# Altium schematic sheet Sheet8.SchDoc
size 368 x 398 mm
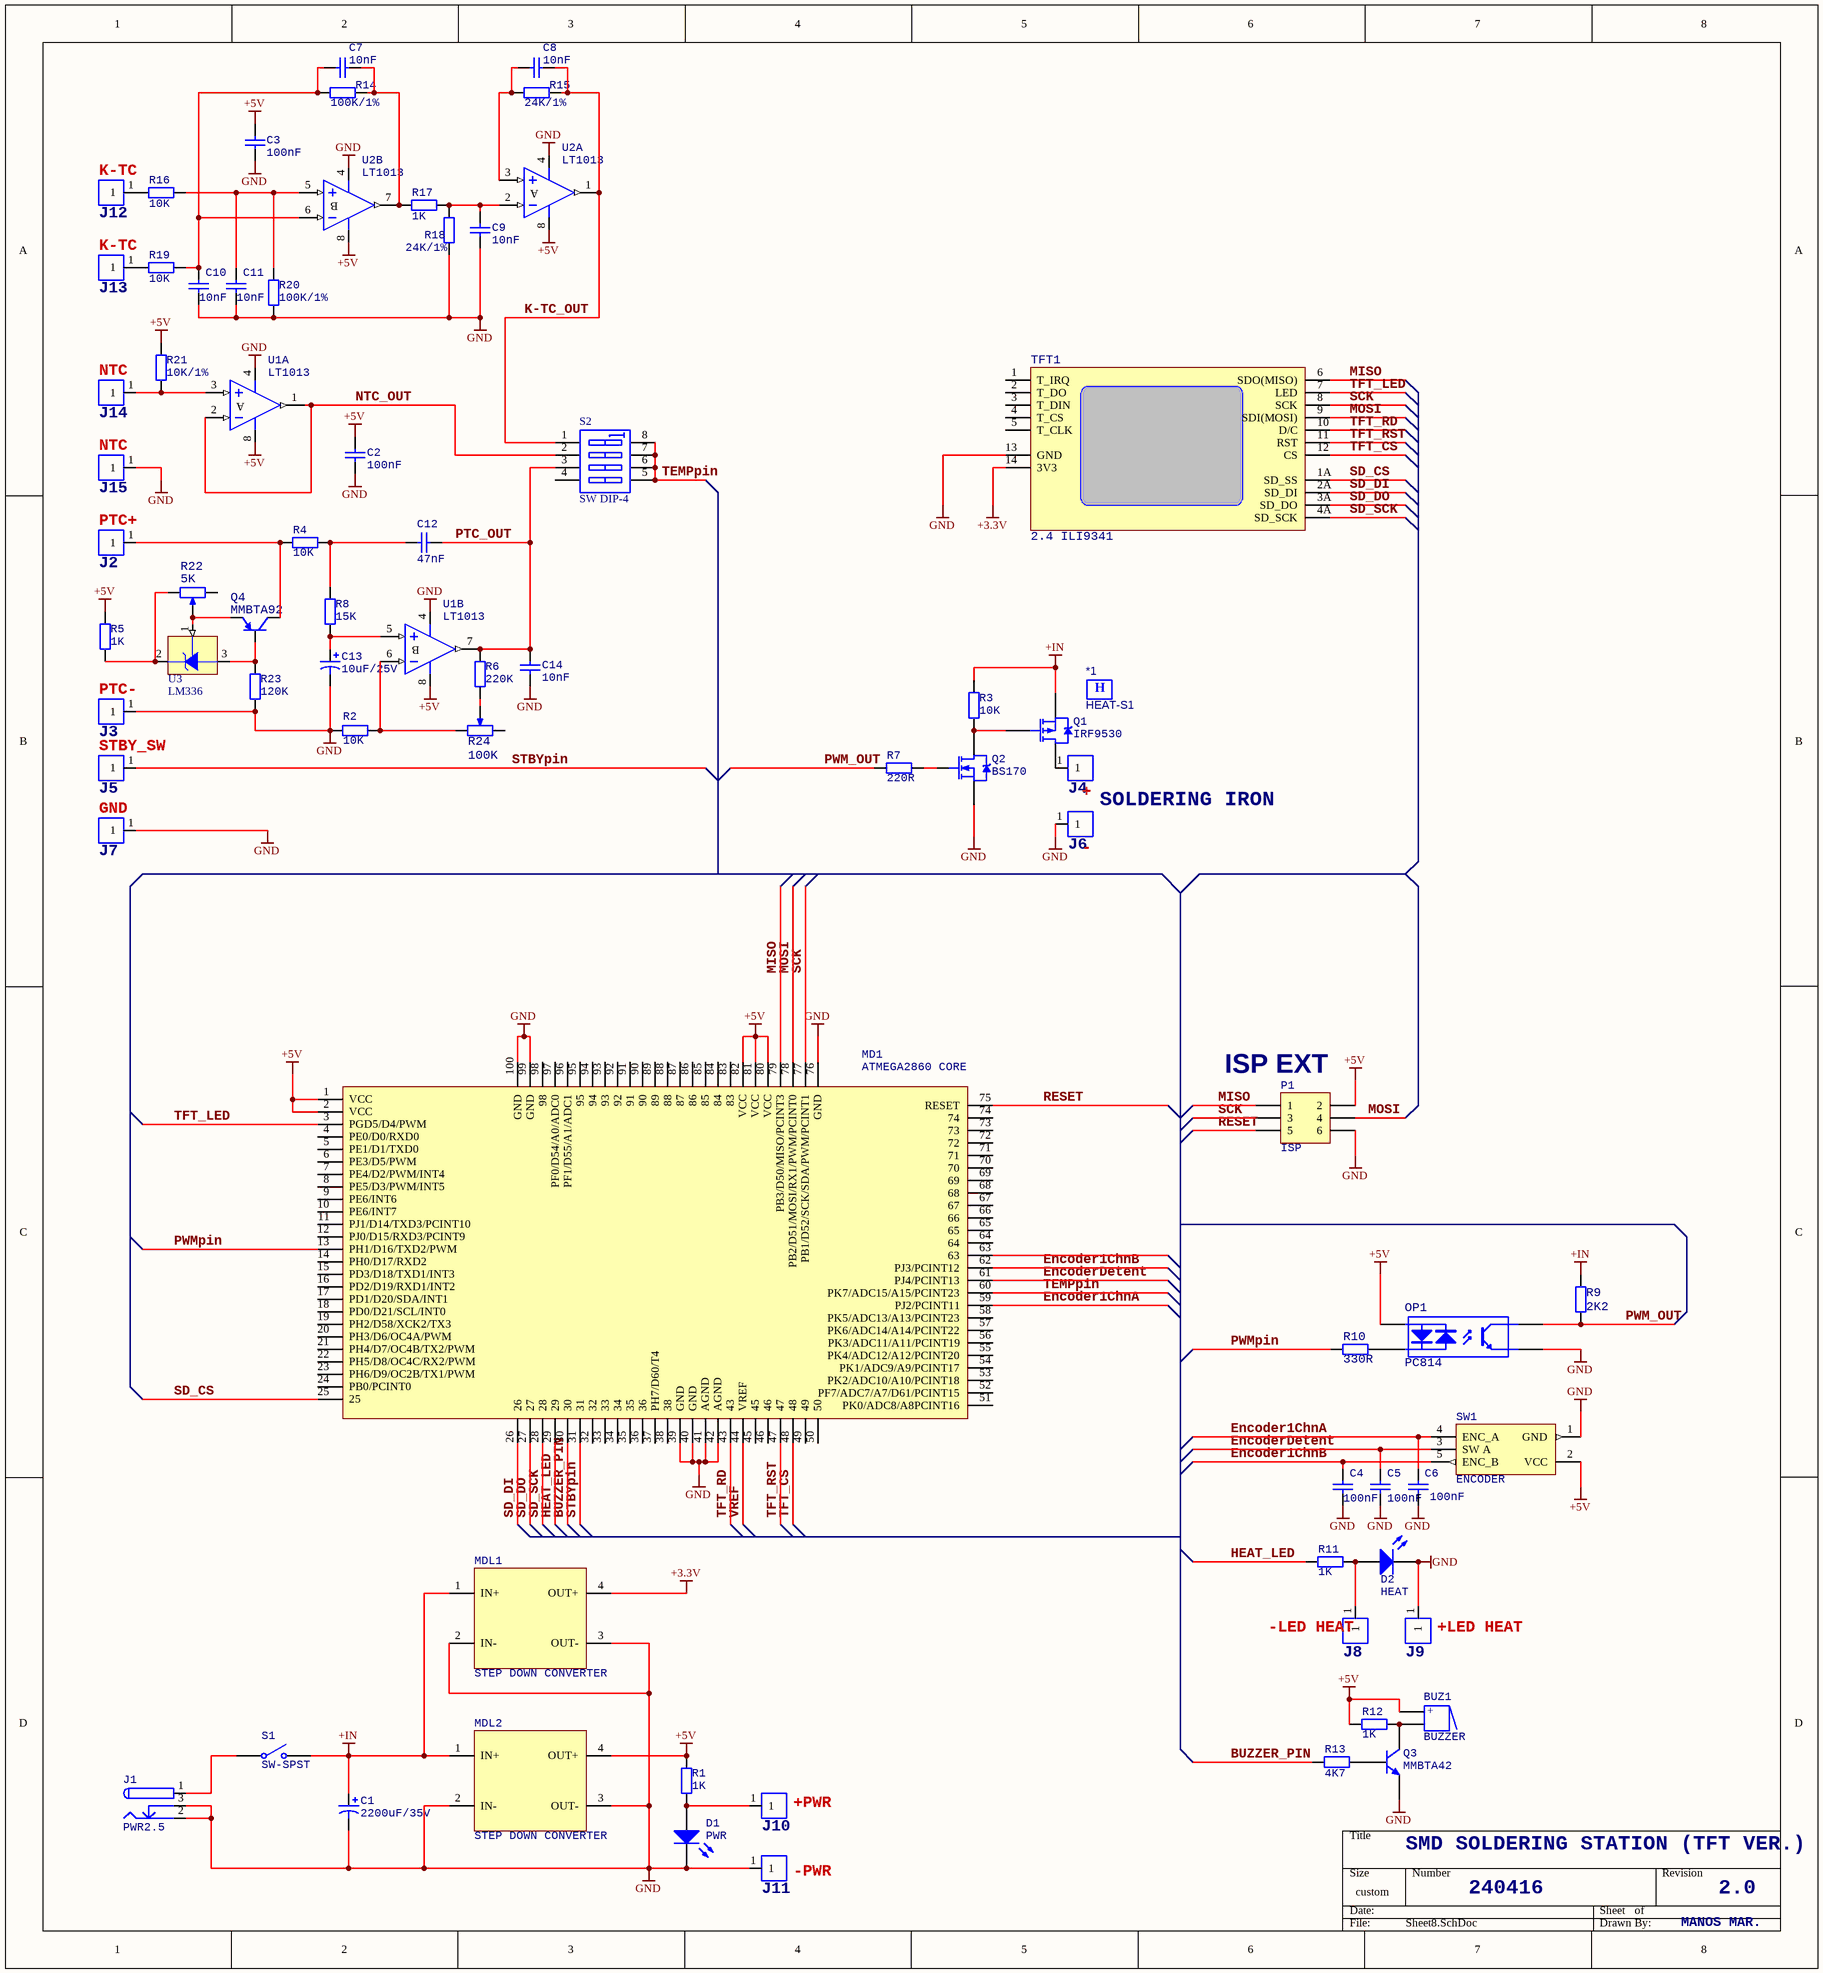
[diagram p0: Sheet8.SchDoc]

## Parts
*1  HEAT-S1  [SK 104 HEATSHINK]
BUZ1  BUZZER  [BUZZER]
C1  2200uF/35V  [RB5-10.5]
C2  100nF  [0805]
C3  100nF  [0805]
C4  100nF  [0805]
C5  100nF  [0805]
C6  100nF  [0805]
C7  10nF  [0805]
C8  10nF  [0805]
C9  10nF  [0805]
C10  10nF  [0805]
C11  10nF  [0805]
C12  47nF  [0805]
C13  10uF/25V  [RB-08]
C14  10nF  [0805]
D1  PWR  [1206D]
D2  HEAT  [1206D]
J1  PWR2.5  [POWER JACK]
J2  PTC+  [CON2]
J3  PTC-  [CON2]
J4  +  [CON2]
J5  STBY_SW  [CON2]
J6  -  [CON2]
J7  GND  [CON2]
J8  -LED HEAT  [CON2]
J9  +LED HEAT  [CON2]
J10  +PWR  [CON2]
J11  -PWR  [CON2]
J12  K-TC  [CON2]
J13  K-TC  [CON2]
J14  NTC  [CON2]
J15  NTC  [CON2]
MD1  ATMEGA2860 CORE  [ATMEGA 2560 CORE]
MDL1  STEP DOWN CONVERTER  [STEP DOWN CONVERTER MINI]
MDL2  STEP DOWN CONVERTER  [STEP DOWN CONVERTER MINI]
OP1  PC814  [SOP-4]
P1  ISP  [HDR2X3]
Q1  IRF9530  [TO-220V]
Q2  BS170  [T0-92]
Q3  MMBTA42  [SO-G3]
Q4  MMBTA92  [SO-G3]
R1  1K  [0805]
R2  10K  [0805]
R3  10K  [0805]
R4  10K  [0805]
R5  1K  [0805]
R6  220K  [0805]
R7  220R  [0805]
R8  15K  [0805]
R9  2K2  [0805]
R10  330R  [0805]
R11  1K  [0805]
R12  1K  [0805]
R13  4K7  [0805]
R14  100K/1%  [0805]
R15  24K/1%  [0805]
R16  10K  [0805]
R17  1K  [0805]
R18  24K/1%  [0805]
R19  10K  [0805]
R20  100K/1%  [0805]
R21  10K/1%  [0805]
R22  5K  [VR6]
R23  120K  [0805]
R24  100K  [VR6]
S1  SW-SPST  [SPST-2]
S2  SW DIP-4  [DIP-8]
SW1  ENCODER  [HDR1X5]
TFT1  2.4 ILI9341  [HDR1X18]
U1  LT1013  [DIP-8]  (parts A,B of 2)
U2  LT1013  [DIP-8]  (parts A,B of 2)
U3  LM336  [Z03A]

## Nets
+3.3V: MDL1.4(OUT+) TFT1.14(3V3)
+5V: BUZ1.1 C2.2 C3.2 MD1.1(VCC) MD1.2(VCC) MD1.80(VCC) MD1.81(VCC) MD1.82(VCC) MDL2.4(OUT+) OP1.1(A) P1.2 R1.2 R5.2 R12.2 R21.2 SW1.2(VCC) U1.8(V+) U2.8(V+)
+IN: C1.1 MDL1.1(IN+) MDL2.1(IN+) Q1.3(S) R3.2 R9.1 S1.2(NO)
GND: C1.2 C2.1 C3.1 C4.2 C5.2 C6.2 C9.2 C10.1 C11.1 C13.2 C14.1 D1.2(K) D2.2(K) J1.2 J1.3 J3.1 J6.1 J7.1 J9.1 J11.1 J15.1 MD1.39(GND) MD1.40(GND) MD1.41(AGND) MD1.42(AGND) MD1.76(GND) MD1.99(GND) MD1.100(GND) MDL1.2(IN-) MDL1.3(OUT-) MDL2.2(IN-) MDL2.3(OUT-) OP1.3(E) P1.6 Q2.3(S) Q3.2(E) R2.2 R18.2 R20.1 R23.1 SW1.1(GND) TFT1.13(GND) U1.4(V-) U2.4(V-)
BUZZER_PIN: MD1.30 R13.1
Encoder1ChnA: C6.1 MD1.59(PJ2/PCINT11) SW1.4(ENC_A)
Encoder1ChnB: C4.1 MD1.62(PJ3/PCINT12) SW1.5(ENC_B)
EncoderDetent: C5.1 MD1.61(PJ4/PCINT13) SW1.3(SW_A)
HEAT_LED: MD1.29 R11.1
K-TC_OUT: C8.1 R15.1 S2.1(A1) U2.1(OUT)
MISO: MD1.79(PB3/D50/MISO/PCINT3) P1.1 TFT1.6(SDO(MISO))
MOSI: MD1.78(PB2/D51/MOSI/RX1/PWM/PCINT0) P1.4 TFT1.9(SDI(MOSI))
NTC_OUT: S2.2(A2) U1.1(OUT) U1.2(IN-)
PTC_OUT: C12.1 C14.2 R6.1 S2.3(A3) U1.7(OUT)
PWM_OUT: OP1.4(C) R7.1 R9.2
PWMpin: MD1.13(PH1/D16/TXD2/PWM) R10.2
RESET: MD1.75(RESET) P1.5
SCK: MD1.77(PB1/D52/SCK/SDA/PWM/PCINT1) P1.3 TFT1.8(SCK)
SD_CS: MD1.25 TFT1.1A(SD_SS)
SD_DI: MD1.26 TFT1.2A(SD_DI)
SD_DO: MD1.27 TFT1.3A(SD_DO)
SD_SCK: MD1.28 TFT1.4A(SD_SCK)
STBYpin: J5.1 MD1.31
TEMPpin: MD1.60(PK7/ADC15/A15/PCINT23) S2.5(B4) S2.6(B3) S2.7(B2) S2.8(B1)
TFT_CS: MD1.48 TFT1.12(CS)
TFT_LED: MD1.3(PGD5/D4/PWM) TFT1.7(LED)
TFT_RD: MD1.43 TFT1.10(D/C)
TFT_RST: MD1.47 TFT1.11(RST)
VREF: MD1.44(VREF)
NetBUZ1_2: BUZ1.2 Q3.3(C) R12.1
NetC7_1: C7.1 R14.1 R17.2 U2.7(OUT)
NetC7_2: C7.2 C10.2 R14.2 R19.1 U2.6(IN-)
NetC8_2: C8.2 R15.2 U2.3(IN+)
NetC9_1: C9.1 R17.1 R18.1 U2.2(IN-)
NetC11_2: C11.2 R16.1 R20.2 U2.5(IN+)
NetC12_2: C12.2 R4.2 R8.1
NetC13_1: C13.1 R8.2 U1.5(IN+)
NetD1_1: D1.1(A) J10.1 R1.1
NetD2_1: D2.1(A) J8.1 R11.2
NetJ1_1: J1.1 S1.1(COMMON)
NetJ2_1: J2.1 Q4.3(C) R4.1
NetJ4_1: J4.1 Q1.2(D)
NetJ12_1: J12.1 R16.2
NetJ13_1: J13.1 R19.2
NetJ14_1: J14.1 R21.1 U1.3(IN+)
NetOP1_2: OP1.2(K) R10.1
NetQ1_1: Q1.1(G) Q2.2(D) R3.1
NetQ2_1: Q2.1(G) R7.2
NetQ3_1: Q3.1(B) R13.2
NetQ4_1: Q4.1(B) R23.2 U3.3(-V)
NetQ4_2: Q4.2(E) R22.2(TAP) U3.1(ADJ)
NetR2_1: R2.1 R24.1(BOT) U1.6(IN-)
NetR5_1: R5.1 R22.1(TOP) U3.2(+V)
NetR6_2: R6.2 R24.2(TAP)

Not connected (* = marked no-connect by the designer): MD1 4(PE0/D0/RXD0) 5(PE1/D1/TXD0) 6(PE3/D5/PWM) 7(PE4/D2/PWM/INT4) 8(PE5/D3/PWM/INT5) 9(PE6/INT6) 10(PE6/INT7) 11(PJ1/D14/TXD3/PCINT10) 12(PJ0/D15/RXD3/PCINT9) 14(PH0/D17/RXD2) 15(PD3/D18/TXD1/INT3) 16(PD2/D19/RXD1/INT2) 17(PD1/D20/SDA/INT1) 18(PD0/D21/SCL/INT0) 19(PH2/D58/XCK2/TX3) 20(PH3/D6/OC4A/PWM) 21(PH4/D7/OC4B/TX2/PWM) 22(PH5/D8/OC4C/RX2/PWM) 23(PH6/D9/OC2B/TX1/PWM) 24(PB0/PCINT0) 32 33 34 35 36 37(PH7/D60/T4) 38 45 46 49 50 51(PK0/ADC8/A8PCINT16) 52(PF7/ADC7/A7/D61/PCINT15) 53(PK2/ADC10/A10/PCINT18) 54(PK1/ADC9/A9/PCINT17) 55(PK4/ADC12/A12/PCINT20) 56(PK3/ADC11/A11/PCINT19) 57(PK6/ADC14/A14/PCINT22) 58(PK5/ADC13/A13/PCINT23) 63 64 65 66 67 68 69 70 71 72 73 74 83 84 85 86 87 88 89 90 91 92 93 94 95 96(PF1/D55/A1/ADC1) 97(PF0/D54/A0/ADC0) 98; R22 3(BOT); R24 3(TOP); S2 4(A4); TFT1 1(T_IRQ) 2(T_DO) 3(T_DIN) 4(T_CS) 5(T_CLK)

## Notes on the sheet
- SOLDERING IRON
- (near P1) ISP EXT
- SMD SOLDERING STATION (TFT VER.)
- 240416
- MANOS MAR.
- 2.0
- (in symbol BUZZER) +
- (in symbol HEAT-S1) H
- (in symbol LT1013ACJ8, part A) A
- (in symbol LT1013ACJ8, part B) B

## Library data of the parts
C1 C13 = Cap Pol1: Polarized Capacitor (Radial); Value: 100pF; Published: 8-Jun-2000; LatestRevisionDate: 17-Jul-2002; LatestRevisionNote: Re-released for DXP Platform.; PackageReference: RB7.6-15; Publisher: Altium Limited; PackageDescription: Polarized Capacitor (Radial); 2 Leads
C2 C3 C7-C12 C14 = D-101-0085: Capacitor, Ceramic, 4.7uF 10% 16V 0805 (2012) X7R; Polarity: Non-Polarized; Capacitance: 4.7 uF; Dielectric: X7R; Mounting Technology: Surface Mount; Rated Voltage: 16 V; Status: Unreleased; Technology: None; Tolerance: 10 %; Category: Capacitor
C4-C6 = Cap: Capacitor; Value: 100pF; Published: 8-Jun-2000; LatestRevisionDate: 17-Jul-2002; LatestRevisionNote: Re-released for DXP Platform.; PackageReference: RAD-0.3; Publisher: Altium Limited
D1 D2 = LED0: Typical INFRARED GaAs LED; Published: 8-Jun-2000; LatestRevisionDate: 08-Jul-2005; LatestRevisionNote: Mech Layer 1 removed.; PackageReference: LED-0; Publisher: Altium Limited; PackageDescription: LED; 2 Leads
J1 = PWR2.5: Low Voltage Power Supply Connector; Published: 17-Dec-2003; DatasheetDocument: 09-May-2002; Publisher: Altium Limited; ComponentLink1Description: Manufacturer Link; ComponentLink1URL: http://domino.kycon.com/internet/Products.html
J2-J15 = CON1_S: Manufacturer: Sta.Ge HELLAS
MD1 = ATMEGA2560 CORE
OP1 = OPTO-AC1: AC OPTOCUPLER
P1 = Header 3X2: Header, 3-Pin, Dual row; LatestRevisionDate: 17-Jul-2002; LatestRevisionNote: Re-released for DXP Platform.; Publisher: Altium Limited
Q1 = PMOS-2: P-Channel Power MOSFET; Note: Pin 4 not drawn and electrically connected to Pin 2.; Published: 8-Jun-2000; LatestRevisionDate: 17-Jul-2002; LatestRevisionNote: Re-released for DXP Platform.; DatasheetVersion: PD-9.390D; PackageVersion: Feb-1997; PackageReference: TO-220AB; Publisher: Altium Limited; PackageDescription: TO, Thru-Hole, Vertical, Heatsink Mounted; 3 In-Line Leads; Pitch 2.54 mm; ComponentLink1Description: Manufacturer Link; ComponentLink1URL: http://www.irf.com/
Q2 = NMOS-2: N-Channel Power MOSFET; Note: Pin 2 is electrically connected to pin 4.; Published: 8-Jun-2000; LatestRevisionDate: 17-Jul-2002; LatestRevisionNote: Re-released for DXP Platform.; DatasheetVersion: PD-9.814; PackageVersion: Feb-1997; PackageReference: TO-220AB; Publisher: Altium Limited; PackageDescription: TO, Thru-Hole, Vertical, Heatsink Mounted; 3 In-Line Leads; Pitch 2.54 mm; ComponentLink1Description: Manufacturer Link; ComponentLink1URL: http://www.irf.com/
Q3 = NPN: NPN Bipolar Transistor; Published: 8-Jun-2000; LatestRevisionDate: 17-Jul-2002; LatestRevisionNote: Re-released for DXP Platform.; PackageReference: TO-226; Publisher: Altium Limited; Code_JEDEC: TO-226-AA
Q4 = PNP: PNP Bipolar Transistor; Published: 8-Jun-2000; LatestRevisionDate: 17-Jul-2002; LatestRevisionNote: Re-released for DXP Platform.; PackageReference: SOT-23B; Publisher: Altium Limited; Code_JEDEC: SOT-23
R1 R11 = Res2: Resistor; Published: 8-Jun-2000; LatestRevisionDate: 17-Jul-2002; LatestRevisionNote: Re-released for DXP Platform.; PackageReference: AXIAL-0.4; Publisher: Altium Limited; PackageDescription: Axial Device, Thru-Hole; 2 Leads; 0.4 in Pin Spacing; Value: 1K
R2 R4-R6 R8-R10 R12-R21 R23 = RES: Manufacturer: Generic Components; SGPartNumber: R001051; Value: 5,6Kohm; Class I: Passive; Class II: Resistor; Power: 0,2W; Type1: SMD; Type2: MG; Tolerance: 5%; Revision: July-2002: Re-released for DXP Platform.; Published: 8-Jun-2000; Publisher: Altium Limited; Package: 1206; Packaging: TAPE & REEL (TR); Resistance: 5,6KOhm
R3 R7 = Res2: Resistor; Value: 1K; Published: 8-Jun-2000; LatestRevisionDate: 17-Jul-2002; LatestRevisionNote: Re-released for DXP Platform.; PackageReference: AXIAL-0.4; Publisher: Altium Limited; PackageDescription: Axial Device, Thru-Hole; 2 Leads; 0.4 in Pin Spacing
R22 R24 = RPot2: Manufacturer: Sta.Ge HELLAS; SGPartnumber: R001049; Part Number: R002107; Value: 10KOhm; Class I: Passive; Class II: Potentiometer; Power: NU; Tolerance: 10%; Type1: TH; Type3: TRIMMER; Revision: 11-05; Published: 8-Jun-2000; Publisher: Altium Limited; Type: Metal Film; Type2: NU; Resistance: 10KOhm
S1 = SW-SPST: Single-Pole, Single-Throw Switch; Published: 24-Mar-1999; LatestRevisionDate: 17-Jul-2002; LatestRevisionNote: Re-released for DXP Platform.; PackageReference: SPST-2; Publisher: Altium Limited; PackageDescription: Switch; 2 Leads
S2 = SW DIP-4: DIP Switch, 4 Position, SPST; Published: 24-Mar-1999; LatestRevisionDate: 29-May-2009; LatestRevisionNote: IPC-7351 Footprint Added.; PackageVersion: Dec-2002; PackageReference: SO8; Publisher: Altium Limited; PackageDescription: 8-Pin Small Outline Integrated Circuit 1.27 mm Pitch; Code_JEDEC: MS-012-AA; Code_IPC: SOIC127P600-8
SW1 = ROTARY ENC
TFT1 = 2.4 TFT
U1 U2 = LT1013ACJ8: Dual Precision Operational Amplifier; Note: 190; Published: 8-Jun-2000; LatestRevisionDate: 29-May-2009; LatestRevisionNote: Component Body Added.; DatasheetVersion: Jan-1996; PackageVersion: J8 0801; PackageReference: J8; Publisher: Altium Limited; PackageDescription: DIP, Ceramic, 8-Pin, Row Spacing 7.62 mm, Pitch 2.54 mm; ComponentLink1Description: Manufacturer Link; ComponentLink1URL: http://www.linear.com/; ComponentLink2Description: Datasheet; ComponentLink2URL: http://www.linear.com/pc/downloadDocument.do?navId=H0,C1,C1154,C1009,C1021,P1223,D3743
U3 = LM385Z: Adjustable Micropower Voltage Reference; Published: 15-Apr-2002; DatasheetVersion: Jun-1999; PackageVersion: 2000; PackageReference: Z03A; Publisher: Altium Limited; PackageDescription: TO, Flat Index; 3 In-Line, Axial Leads; Body Dia. 4.6mm; Leads 0.53 x 0.39 mm (max); ComponentLink1Description: Manufacturer Link; ComponentLink1URL: http://www.national.com/; ComponentLink2Description: Datasheet; ComponentLink2URL: http://www.national.com/ds.cgi/LM/LM185-ADJ.pdf; ComponentLink3Description: URL Link1; ComponentLink3URL: http://www.national.com/pf/LM/LM385-ADJ.html